# EAGLE design untitled (EAGLE 7.5.0)
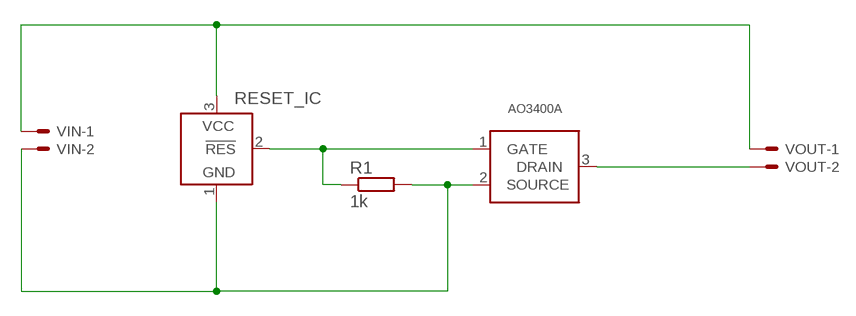
[diagram p0: schematic, sheet 1]

## Parts
MOSFET  AO3400A  [SOT-23]
R1  1k  R-EU_R1206  [R1206]
RESET_IC  TCM809  [SOT23B-3]
VIN  22-23-2021  [22-23-2021]
VOUT  22-23-2021  [22-23-2021]

## Nets
GND: MOSFET.2(SOURCE) R1.2 RESET_IC.1(GND) VIN.2
N$1: MOSFET.3(DRAIN) VOUT.2
N$3: MOSFET.1(GATE) R1.1 RESET_IC.2(!RES)
VCC: RESET_IC.3(VCC) VIN.1 VOUT.1

## Library data of the parts
MOSFET = smd-footprints:AO3400A
R1 = resistor:R-EU_: RESISTOR, European symbol
RESET_IC = telcom:TCM809: POWER SUPPLY MONITOR replacement for Maxim MAX809 and MAX810; MF: MICROCHIP; MPN: TCM809MENB713; OC_FARNELL: 9762744; OC_NEWARK: 96K3998
VIN VOUT = con-molex:22-23-2021: .100" (2.54mm) Center Header - 2 Pin; MF: MOLEX; MPN: 22-23-2021; OC_FARNELL: 1462926; OC_NEWARK: 25C3832

## Board
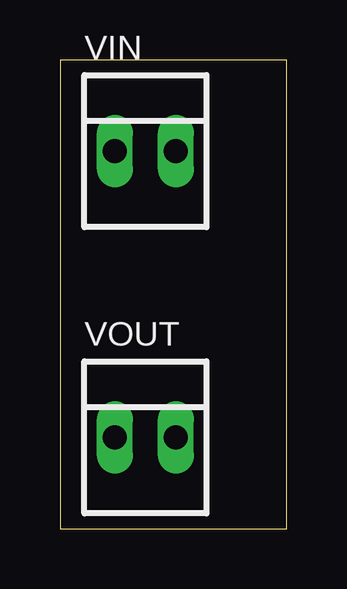
[diagram p1: board, top side]
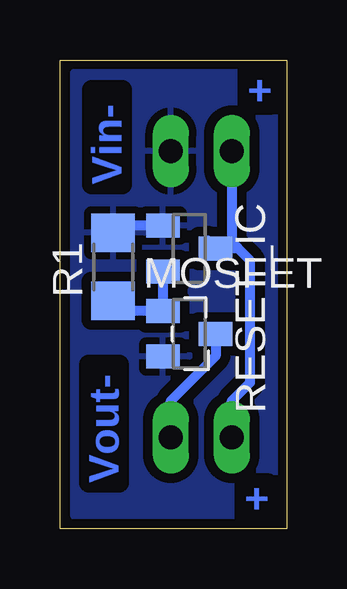
[diagram p2: board, bottom side, seen from below]

Size 9.45 x 19.55 mm. Coordinates in mm from the lower left corner, seen from the top.
Outline: 0,0 9.45,0 9.45,19.55 0,19.55 0,0
Copper layers (1*16): Top 0.035mm / dielectric 1.5mm / Bottom 0.035mm
Design rules "default 16mils": minimum track width 10mil, minimum drill 24mil, track to track 16mil, track to pad 16mil, pad to pad 16mil, via to via 16mil, smd to smd 10mil, copper to edge 10mil, drill to drill 10mil, minimum pad ring 10mil, minimum via ring 8mil, stop-mask expansion 4mil, vias tented up to drill 0mil, thermal gap 12mil

### Footprints (pad centres in the part's own frame; a part is rotated, then mirrored left to right if it is on the bottom)
SOT-23 = smd 1 x 1.4: 1 -0.95,-1.1; 2 0.95,-1.1; 3 0,1.1
R1206 = smd 1.6 x 1.803: 1 -1.422,0; 2 1.422,0
SOT23B-3 = smd 1 x 1.4: 1 -0.95,-1.1; 2 0.95,-1.1; 3 0,1.1
22-23-2021 = drill 1 long: 1 -1.27,0; 2 1.27,0

### Placement (x,y rotation side)
MOSFET  4.06,8.13 270 bottom
R1  [R1206]  7.24,10.92 90 bottom
RESET_IC  4.06,11.68 270 bottom
VIN  3.56,15.75 0 top
VOUT  3.56,3.81 0 top

### Tracks (layer width: path | path; a pad name or v marks a point on that pad's centre or on a via)
GND
  Bottom 0.406: RESET_IC.1 6.95,12.63 R1.2
  pour Bottom: 0.51,0.51 8.89,0.51 8.89,19.05 0.51,19.05
N$1
  Bottom 0.406: MOSFET.3 2.96,7.2 4.83,5.33 VOUT.2
N$2
  pour Bottom: 0.51,0.51 8.89,0.51 8.89,19.05 0.51,19.05
N$3
  Bottom 0.406: R1.1 6.82,9.08 MOSFET.1 RESET_IC.2
VCC
  Bottom 0.406: 3.3,12.02 RESET_IC.3 2.03,11.68 | 2.03,11.68 1.52,11.18 1.52,6.1 2.29,5.33 VOUT.1 | VIN.1 2.29,11.94 2.03,11.68

### Text on the board
Bottom: + | Vin- | Vout- | +